# EAGLE design max1k (EAGLE 7.2.0)
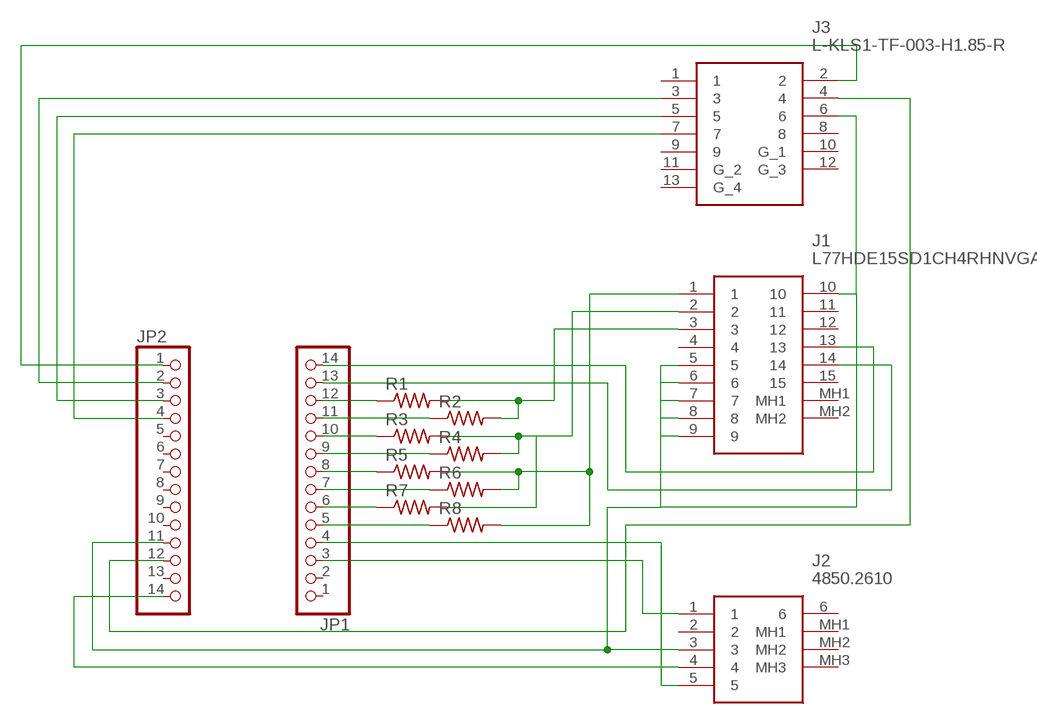
[diagram p0: schematic, sheet 1]

## Parts
J1  L77HDE15SD1CH4RHNVGA  [L77HDE15SD1CH4RHNVGA]
J2  4850.2610  [48502610]
J3  L-KLS1-TF-003-H1.85-R  [L-KLS1-TF-003-H1.85-R]
JP1  PINHD-1X14-CB  [1X14-CB]
JP2  PINHD-1X14-CB  [1X14-CB]
R1  R-US_R0805  [R0805]
R2  R-US_R0805  [R0805]
R3  R-US_R0805  [R0805]
R4  R-US_R0805  [R0805]
R5  R-US_R0805  [R0805]
R6  R-US_R0805  [R0805]
R7  R-US_R0805  [R0805]
R8  R-US_R0805  [R0805]

## Nets
GND: J1.5 J1.6 J1.7 J1.8 J1.9 J1.10 J2.3 J3.6 JP2.11
N$1: J1.13 JP1.14
N$2: J1.14 JP1.13
N$3: JP1.12 R1.1
N$4: JP1.11 R2.1
N$5: JP1.10 R3.1
N$6: JP1.9 R4.1
N$7: JP1.8 R5.1
N$8: JP1.7 R6.1
N$9: JP1.6 R7.1
N$10: JP1.5 R8.1
N$11: J1.3 R1.2 R2.2
N$12: J1.2 R3.2 R4.2 R7.2
N$13: J1.1 R5.2 R6.2 R8.2
N$14: J3.4 JP2.12
N$15: J2.4 JP2.14
N$16: J2.1 JP1.3
N$17: J3.5 JP2.3
N$18: J3.3 JP2.2
N$20: J3.7 JP2.4
N$21: J2.5 JP1.4
N$24: J3.2 JP2.1
Unconnected: J1.4 J1.11 J1.12 J1.15 J1.MH1 J1.MH2 J2.2 J2.6 J2.MH1 J2.MH2 J2.MH3 J3.1 J3.8 J3.9 J3.10(G_1) J3.11(G_2) J3.12(G_3) J3.13(G_4) JP1.1 JP1.2 JP2.5 JP2.6 JP2.7 JP2.8 JP2.9 JP2.10 JP2.13

## Library data of the parts
J1 = dsub15_2.00_L77HDE15SD1CH4RHNVGA:L77HDE15SD1CH4RHNVGA: D-Sub High Density Connectors Dsub, Stamped Signal 3A, High Density, Right Angle PCB Thru Hole, FP=8.89mm (.350"), 15 Socket, Bright Tin Shell, Flash Gold, 4-40 Rear Insert, Ground Tab with Boardlock, High Temp, Nickel Shell, VGA Source: Datasheet <https://componentsearchengine.com/Datasheets/1/L77HDE15SD1CH4RHNVGA.pdf>; DESCRIPTION: D-Sub High Density Connectors Dsub, Stamped Signal 3A, High Density, Right Angle PCB Thru Hole, FP=8.89mm (.350"), 15 Socket, Bright Tin Shell, Flash Gold, 4-40 Rear Insert, Ground Tab with Boardlock, High Temp, Nickel Shell, VGA; HEIGHT: 12.55mm; MANUFACTURER_NAME: Amphenol; MANUFACTURER_PART_NUMBER: L77HDE15SD1CH4RHNVGA; MOUSER_PART_NUMBER: 523-7HDE15SDH4RHNVGA; MOUSER_PRICE-STOCK: https://www.mouser.co.uk/ProductDetail/Amphenol-Commercial-Products/L77HDE15SD1CH4RHNVGA?qs=f9yNj16SXrKPVxRw%2FcVQYg%3D%3D
J2 = mini_din_4850.2610:4850.2610: SCHURTER - 4850.2610 - RECEPTACLE, MINI-DIN, PCB, THT, RA, 6WAY Source: Datasheet <http://www.schurterinc.com/bundles/snceschurter/epim/_ProdPool_/newDS/en/typ_4850.2610.pdf>; ALLIED_NUMBER: 70597687; ALLIED_PRICE-STOCK: https://www.alliedelec.com/schurter-4850-2610/70597687/; DESCRIPTION: SCHURTER - 4850.2610 - RECEPTACLE, MINI-DIN, PCB, THT, RA, 6WAY; HEIGHT: 12mm; MANUFACTURER_NAME: SCHURTER; MANUFACTURER_PART_NUMBER: 4850.2610; MOUSER_PART_NUMBER: 693-4850.2610; MOUSER_PRICE-STOCK: https://www.mouser.com/Search/Refine.aspx?Keyword=693-4850.2610
J3 = L-KLS1-TF-003-H1.85-R:L-KLS1-TF-003-H1.85-R: Micro SD Card Connector Source: Datasheet <https://img.ozdisan.com/ETicaret_Dosya/476392_7149645.pdf>; DESCRIPTION: Micro SD Card Connector; HEIGHT: mm; MANUFACTURER_NAME: KLS Electronic; MANUFACTURER_PART_NUMBER: L-KLS1-TF-003-H1.85-R
JP1 JP2 = adafruit:PINHD-1X14: PIN HEADER
R1-R8 = adafruit:R-US_: RESISTOR, American symbol

## Net classes
0 default: width 0.3 mm, drill 0.6 mm, clearance 0.2 mm

## Board
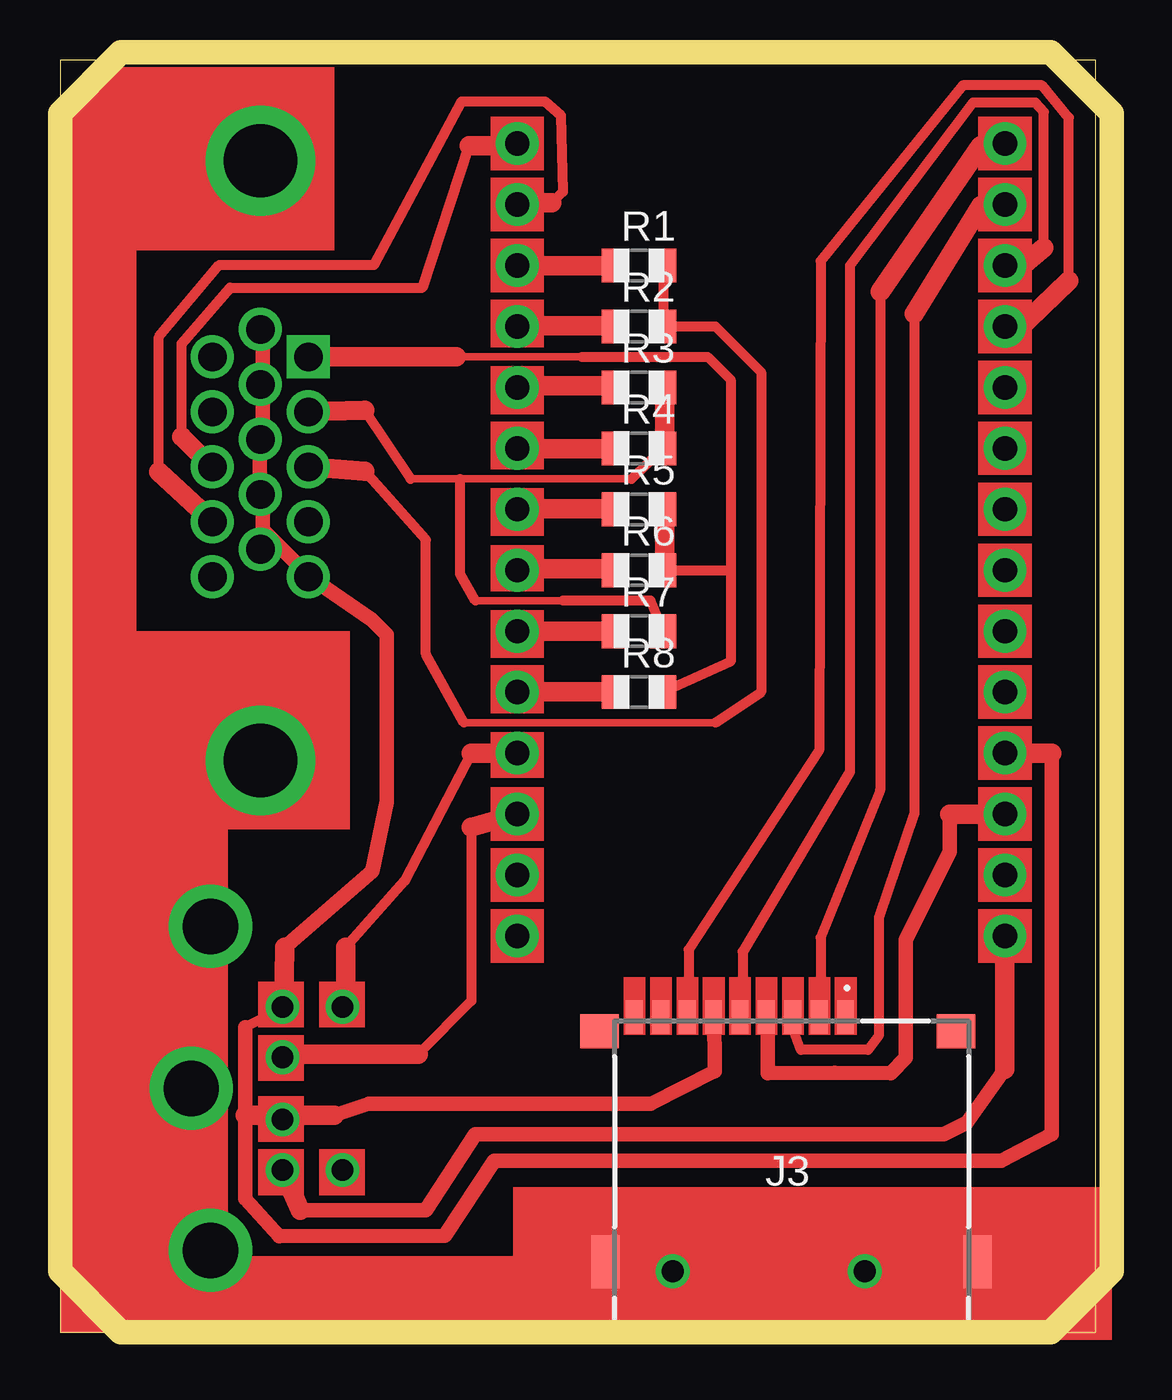
[diagram p1: board, top side]
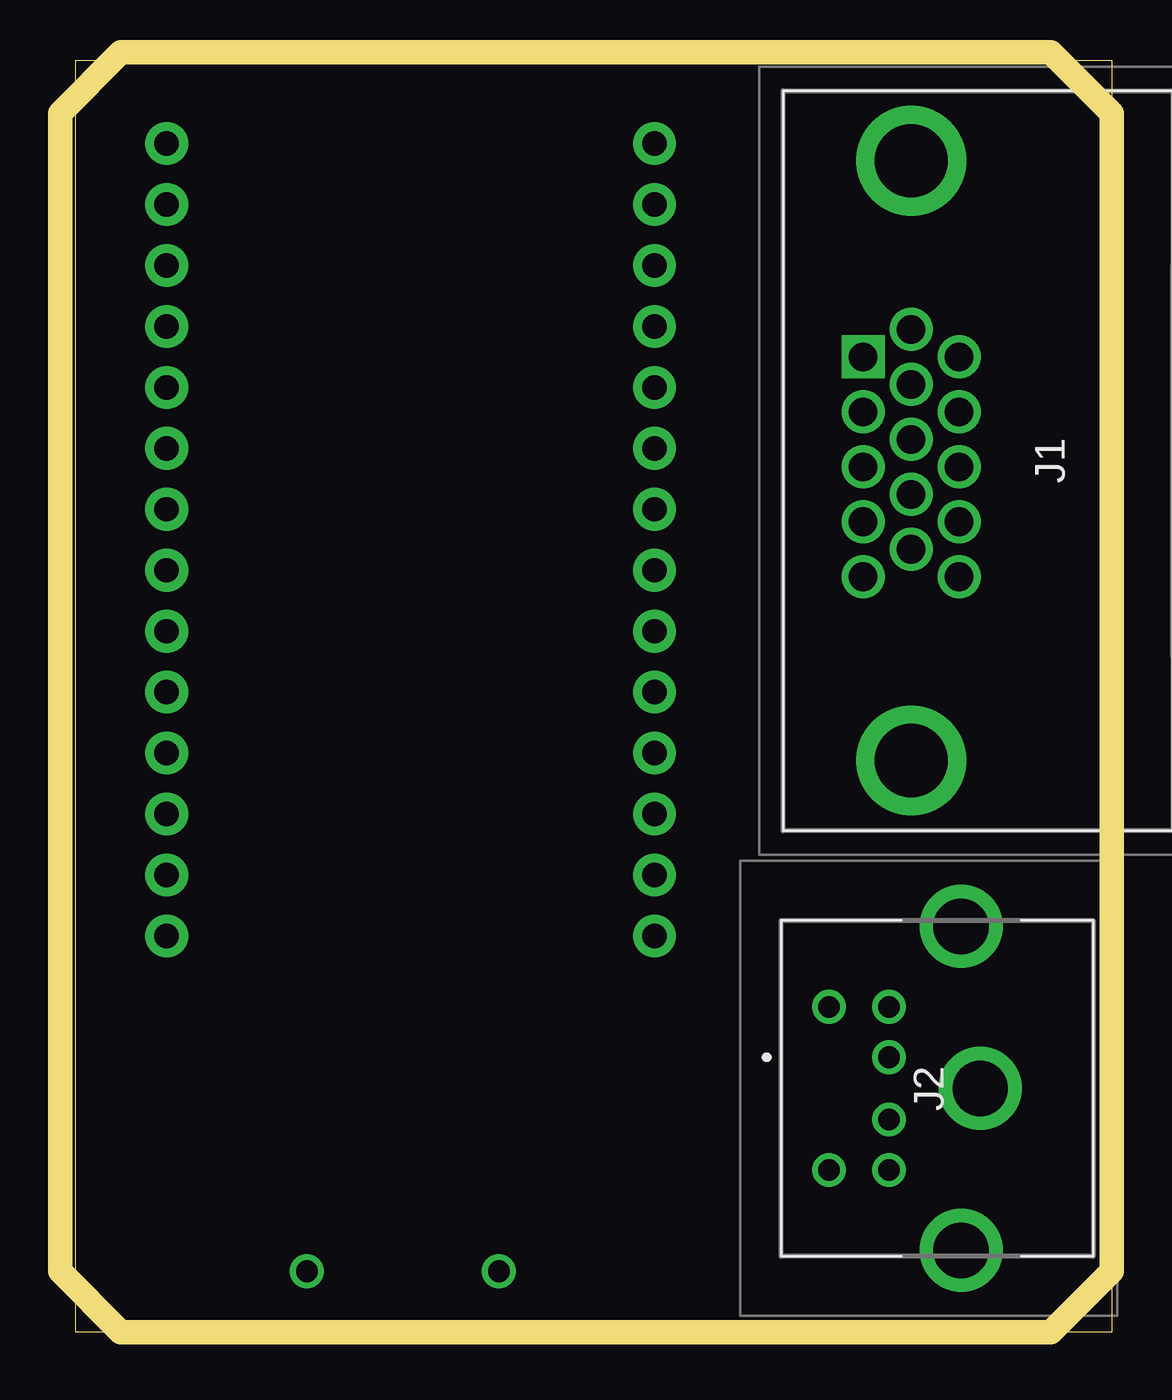
[diagram p2: board, bottom side, seen from below]

Size 43.16 x 53.01 mm. Coordinates in mm from the lower left corner, seen from the top.
Outline: 0,0 43.16,0 43.16,53.01 0,53.01 0,0
Copper layers (1*16): Top 0.035mm / dielectric 1.5mm / Bottom 0.035mm
Design rules "default": minimum track width 10mil, minimum drill 24mil, track to track 8mil, track to pad 8mil, pad to pad 8mil, via to via 8mil, smd to smd 8mil, copper to edge 40mil, drill to drill 8mil, minimum pad ring 10mil, minimum via ring 8mil, stop-mask expansion 4mil, vias tented up to drill 0mil, thermal gap 10mil
Milling: 8 lines

### Footprints (pad centres in the part's own frame; a part is rotated, then mirrored left to right if it is on the bottom)
L77HDE15SD1CH4RHNVGA = drill 1.19 pad 1.785 square: 1 0,4 | drill 1.19 pad 1.785: 2 -2.29,4; 3 -4.58,4; 4 -6.87,4; 5 -9.16,4; 6 1.145,2; 7 -1.145,2; 8 -3.435,2; 9 -5.725,2; 10 -8.015,2; 11 0,0; 12 -2.29,0; 13 -4.58,0; 14 -6.87,0; 15 -9.16,0 | drill 3.05 pad 4.575: MH1 8.17,2; MH2 -16.82,2
48502610 = drill 0.9 pad 1.4: 1 1.3,1.65; 2 -1.3,1.65; 3 3.4,1.65; 4 -3.4,1.65; 5 3.4,4.15; 6 -3.4,4.15 | drill 2.309 pad 3.463: MH1 -6.75,-1.35; MH2 6.75,-1.35; MH3 0,-2.15
L-KLS1-TF-003-H1.85-R = smd 0.7 x 1.4: 1 2.25,10.6; 2 1.15,10.6; 3 0.05,10.6; 4 -1.05,10.6; 5 -2.15,10.6; 6 -3.25,10.6; 7 -4.35,10.6; 8 -5.45,10.6; 9 -6.55,10.6 | smd 1.6 x 1.4: 10 -8,10; 13 6.85,10 | smd 1.2 x 2.2: 11 -7.75,0.4; 12 7.75,0.4 | drill 0.9 pad 1.4: 14 3.05,0; 15 -4.95,0
1X14-CB = drill 1.016 pad 1.778: 1 -16.51,0; 2 -13.97,0; 3 -11.43,0; 4 -8.89,0; 5 -6.35,0; 6 -3.81,0; 7 -1.27,0; 8 1.27,0; 9 3.81,0; 10 6.35,0; 11 8.89,0; 12 11.43,0; 13 13.97,0; 14 16.51,0
R0805 = smd 1.1 x 1.4: 1 -1,0; 2 1,0

### Placement (x,y rotation side)
J1  6.35,40.64 90 bottom
J2  7.62,10.16 90 bottom
J3  30.48,2.54 0 top
JP1  19.05,33.02 90 top
JP2  39.37,33.02 270 top
R1  24.13,44.45 0 top
R2  24.13,41.91 0 top
R3  24.13,39.37 0 top
R4  24.13,36.83 0 top
R5  24.13,34.29 0 top
R6  24.13,31.75 0 top
R7  24.13,29.21 0 top
R8  24.13,26.67 0 top

### Tracks (layer width: path | path; a pad name or v marks a point on that pad's centre or on a via)
GND
  Top 0.3: 8.44,39.57 J1.7 8.44,39.44 | 8.44,41.69 J1.6 | 8.44,32.69 J1.10 | 8.44,34.82 J1.9 8.32,35.07 | 10.32,31.57 J1.5 10.44,31.44 | 8.32,37.19 J1.8 8.44,37.32 | 9.19,13.44 J2.3 9.32,13.69
  Top 0.406: 9.19,13.44 7.72,12.7
  Top 0.61: 8.44,41.69 8.44,39.57 | 8.44,34.82 8.44,32.69 | 10.32,31.57 8.57,33.32 J1.10 | 8.32,35.07 8.32,37.19 | 8.44,37.32 8.44,39.44 | J3.6 27.29,11.77 27.29,10.87 24.62,9.52 12.86,9.53 11.43,9.05 | 41.33,24.13 41.33,8.26 39.21,7.14 18.1,7.14 16.03,4.03 9.13,4 7.72,5.56 7.72,9.05 7.72,12.7 | 10.44,31.44 12.98,29.69 13.61,29.07 13.61,22.11 13.02,19.21 9.37,16.03
  Top 0.813: 11.43,9.05 7.72,9.05 | 9.32,13.69 9.37,16.03 | JP2.11 41.33,24.13
N$1
  Top 0.3: 18.94,49.44 JP1.14 | 6.32,36.07 J1.13
  Top 0.406: 17.06,49.44 15.11,43.53 7.09,43.53 5.07,41.19 5.07,37.32
  Top 0.813: 17.06,49.44 18.94,49.44 | 6.32,36.07 5.07,37.32
N$2
  Top 0.3: 19.07,47.07 JP1.13 | 6.32,33.82 J1.14
  Top 0.406: 20.49,47.06 20.95,47.51 20.87,50.7 20.2,51.29 16.73,51.29 13.08,44.47 6.64,44.47 4.12,41.47 4.12,35.85
  Top 0.813: 20.49,47.06 19.07,47.07 | 6.32,33.82 4.12,35.85
N$3
  Top 0.3: 23.07,44.44 R1.1 | 19.07,44.44 JP1.12
  Top 0.813: 19.07,44.44 23.07,44.44
N$4
  Top 0.3: 23.07,41.94 R2.1 | 19.07,41.94 JP1.11
  Top 0.813: 19.07,41.94 23.07,41.94
N$5
  Top 0.3: 23.07,39.44 R3.1 | 19.07,39.44 JP1.10
  Top 0.813: 19.07,39.44 23.07,39.44
N$6
  Top 0.3: 23.07,36.82 R4.1 | 19.07,36.82 JP1.9
  Top 0.813: 19.07,36.82 23.07,36.82
N$7
  Top 0.3: 23.07,34.32 R5.1 | 19.07,34.32 JP1.8
  Top 0.813: 19.07,34.32 23.07,34.32
N$8
  Top 0.3: 23.07,31.82 R6.1 | 19.07,31.82 JP1.7
  Top 0.813: 19.07,31.82 23.07,31.82
N$9
  Top 0.813: JP1.6 R7.1
N$10
  Top 0.3: 23.07,26.69 R8.1 | 19.07,26.69 JP1.5
  Top 0.813: 19.07,26.69 23.07,26.69
N$11
  Top 0.3: 25.19,41.82 R2.2
  Top 0.305: 27.31,25.4 16.83,25.4
  Top 0.406: R1.2 R2.2 27.31,41.91 29.21,40.01 29.21,26.67 27.31,25.4 | 16.83,25.4 15.24,28.26 15.24,33.02 12.7,35.88
  Top 0.813: 12.7,35.88 J1.3
N$12
  Top 0.3: 25.19,36.94 R4.2 | 25.19,39.32 R3.2
  Top 0.305: 23.81,35.56 16.67,35.56 14.61,35.56 | 20.96,30.48 17.3,30.48
  Top 0.406: R4.2 23.81,35.56 | 14.61,35.56 12.7,38.42 | R7.2 24.61,30.48 20.96,30.48 | 17.3,30.48 16.67,31.59 16.67,35.56
  Top 0.813: 25.19,39.32 25.19,36.94 | 12.7,38.42 J1.2
N$13
  Top 0.3: 25.19,31.82 R6.2 | 25.19,34.19 R5.2
  Top 0.305: 16.51,40.64 21.75,40.64
  Top 0.406: 27.94,31.75 27.94,39.69 26.99,40.64 21.75,40.64 | 27.94,31.75 27.94,27.94 R8.2 | R6.2 27.94,31.75
  Top 0.813: 25.19,34.19 25.19,31.82 | J1.1 16.51,40.64
N$14
  Top 0.3: 29.49,12.79 29.47,13.22 J3.4
  Top 0.61: 29.49,12.79 29.49,10.79 32.28,10.81 34.61,10.8 35.24,11.43 35.24,16.35 37.07,20.01 37.07,21.59
  Top 0.813: JP2.12 37.07,21.59
N$15
  Top 0.61: 39.37,10.95 37.78,8.73 36.83,8.26 17.3,8.26 15.24,5.08 10,5.08
  Top 0.813: JP2.14 39.37,10.95 | J2.4 10,5.08
N$16
  Top 0.3: 9.37,11.59 J2.1
  Top 0.406: 14.92,11.59 17.15,13.81 17.15,21.03
  Top 0.813: 14.92,11.59 9.37,11.59 | JP1.3 17.15,21.03
N$17
  Top 0.3: 28.44,13.19 J3.5 | 40.08,44.41 JP2.3
  Top 0.406: 28.44,13.19 28.44,15.86 32.92,23.35 32.92,44.44 38.04,51.23 40.64,51.23 40.99,50.84 40.99,45.18
  Top 0.813: 40.08,44.41 40.99,45.18
N$18
  Top 0.3: 30.57,12.57 30.57,13.07 J3.3 | 38.36,46.94 JP2.2
  Top 0.406: 30.57,12.57 30.87,11.77 33.67,11.77 34.13,12.38 34.13,17.3 35.6,21.61 35.6,42.45
  Top 0.813: 38.36,46.94 35.6,42.45
N$20
  Top 0.3: 26.19,13.19 J3.7 | 39.76,41.62 JP2.4
  Top 0.406: 26.19,13.19 26.19,15.94 31.63,24.24 31.69,44.64 37.61,51.96 40.92,51.96 42.03,50.61 42.03,43.82
  Top 0.813: 39.76,41.62 42.03,43.82
N$21
  Top 0.3: 11.91,13.65 J2.5
  Top 0.406: 17.15,24.13 14.37,18.81 11.91,16.03
  Top 0.813: 11.91,16.03 11.91,13.65 | JP1.4 17.15,24.13
N$24
  Top 0.3: 31.69,13.19 J3.2 | 38.36,49.44 JP2.1
  Top 0.406: 31.69,13.19 31.69,16.45 34.18,22.59 34.18,43.35
  Top 0.813: 38.36,49.44 34.18,43.35
(copper drawn outside any net)
  shapes: Top area x49